# EAGLE design dosimeter (EAGLE 9.6.2)

## Sheet 1 of 2
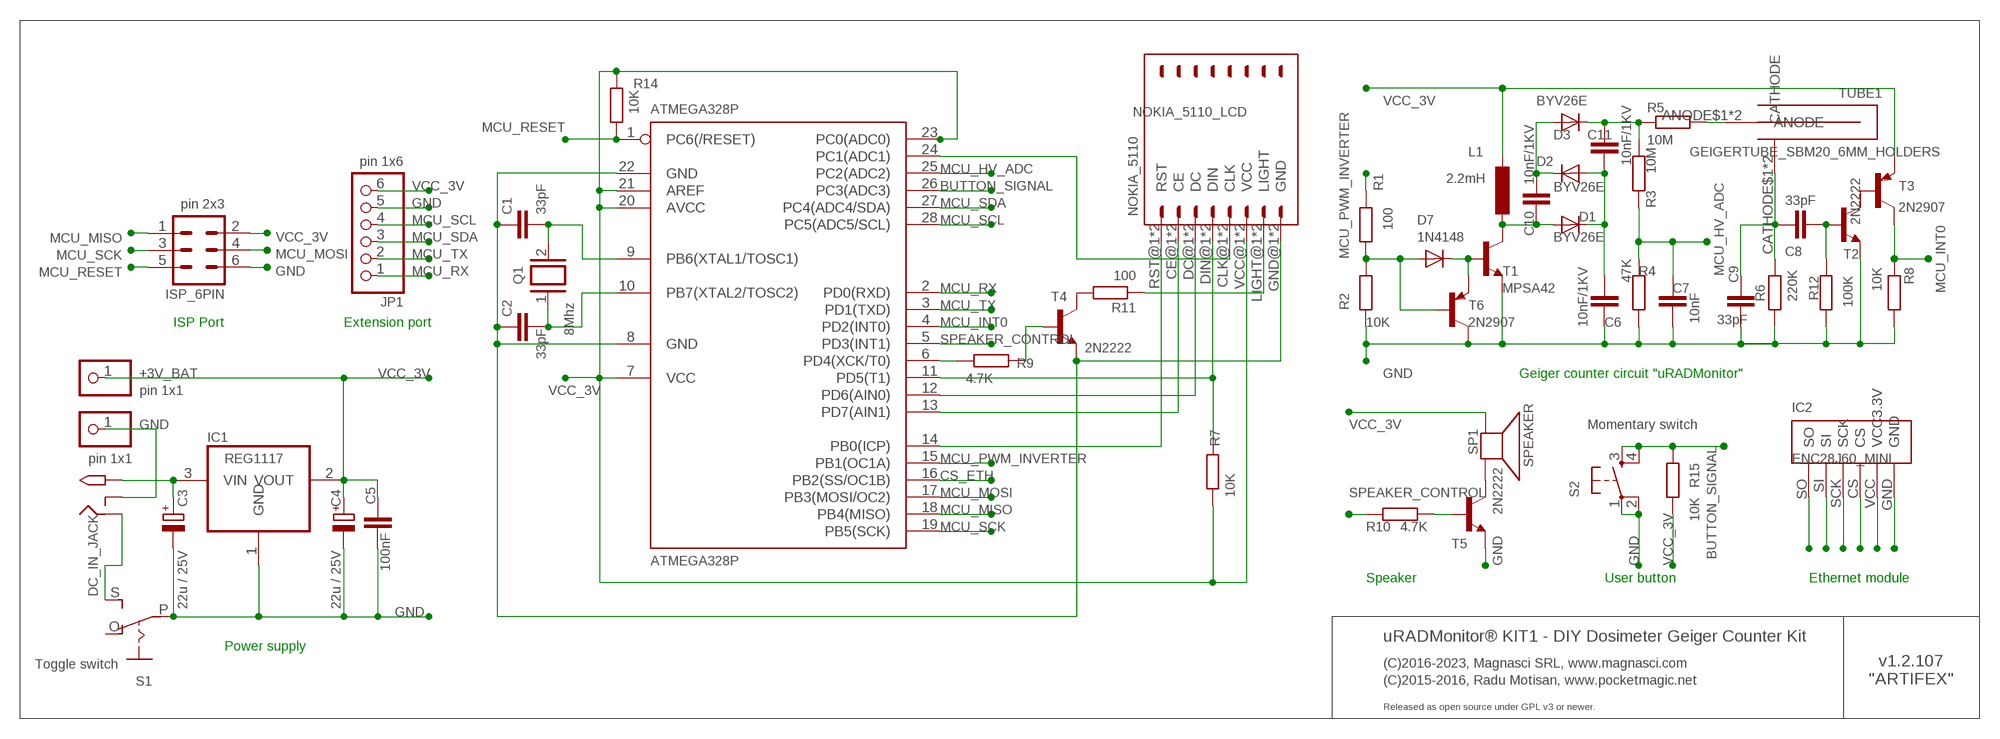
[diagram p0: schematic, sheet 1]

### Parts
+3V_BAT  pin 1x1  PINHD-1X1  [1X01]
ATMEGA328P  ATMEGA328P  MEGA8-P  [DIL28-3]
C1  33pF  C2.5/2  [C2.5-2]
C2  33pF  C2.5/2  [C2.5-2]
C3  22u / 25V  CPOL-EUTT2D4L  [TT2D4L]
C4  22u / 25V  CPOL-EUTT2D4L  [TT2D4L]
C5  100nF  C2.5/2  [C2.5-2]
C6  10nF/1KV  C5/3  [C5B3]
C7  10nF  C2.5/2  [C2.5-2]
C8  33pF  C2.5/2  [C2.5-2]
C9  33pF  C2.5/2  [C2.5-2]
C10  10nF/1KV  C5/3  [C5B3]
C11  10nF/1KV  C5/3  [C5B3]
D1  BYV26E  DIODE-DO41-7.6  [DO41-7.6]
D2  BYV26E  DIODE-DO41-7.6  [DO41-7.6]
D3  BYV26E  DIODE-DO41-7.6  [DO41-7.6]
D7  1N4148  DIODE-D-5  [D-5]
DC_IN_JACK  DC IN JACK  2.1MMJACKTHM  [PJ-102A]
GND  pin 1x1  PINHD-1X1  [1X01]
IC1  REG1117  [SOT223]
IC2  ENC28J60_MINI  [ENC28J60_MINI]
ISP_6PIN  pin 2x3  MA03-2  [MA03-2]
JP1  pin 1x6  PINHD-1X6CLEAN  [1X06-CLEAN]
L1  2.2mH  L-EU0207/10  [0207/10]
NOKIA_5110  NOKIA_5110_LCD  NOKIA5110  [NOKIA5110]
Q1  8Mhz  XTAL/S  [QS]
R1  100  R-EU_0204/7  [0204/7]
R2  10K  R-EU_0204/7  [0204/7]
R3  10M  R-EU_0204/7  [0204/7]
R4  47K  R-EU_0204/7  [0204/7]
R5  10M  R-EU_0204/7  [0204/7]
R6  220K  R-EU_0204/7  [0204/7]
R7  10K  R-EU_0204/7  [0204/7]
R8  10K  R-EU_0204/7  [0204/7]
R9  4.7K  R-EU_0204/7  [0204/7]
R10  4.7K  R-EU_0204/7  [0204/7]
R11  100  R-EU_0204/7  [0204/7]
R12  100K  R-EU_0204/7  [0204/7]
R14  10K  R-EU_0204/7  [0204/7]
R15  10K  R-EU_0204/7  [0204/7]
S1  Toggle switch  EG1218S  [EG1218]
S2  Momentary switch  TAC_SWITCHPTH  [TACTILE-PTH]
SP1  SPEAKER  SPEAKER/AL60P  [AL60P]
T1  MPSA42  2N2222  [TO92-EBC-OVAL]
T2  2N2222  2N2222-NPN-TO92-EBC  [TO92-EBC]
T3  2N2907  [TO92-EBC-OVAL]
T4  2N2222  2N2222-NPN-TO92-EBC  [TO92-EBC]
T5  2N2222  2N2222-NPN-TO92-EBC  [TO92-EBC]
T6  2N2907  [TO92-EBC-OVAL]
TUBE1  GEIGERTUBE_SBM20_6MM_HOLDERS  [GEIGERTUBE_SBM20_6MM_HOLDERS]

### Nets
BUTTON_SIGNAL: ATMEGA328P.26(PC3(ADC3)) R15.1 S2.3 S2.4
CS_ETH: ATMEGA328P.16(PB2(SS/OC1B)) IC2.CS
GND: ATMEGA328P.8(GND) ATMEGA328P.22(GND) C1.1 C2.1 C3.- C4.- C5.1 C6.2 C7.1 C9.2 IC1.1(GND) IC2.GND ISP_6PIN.6 JP1.5 NOKIA_5110.GND@1(GND) NOKIA_5110.GND@2(GND) R2.1 R4.2 R6.1 R8.2 R12.2 S1.P S2.1 S2.2 T1.E T2.E T4.E T5.E T6.C
MCU_HV_ADC: ATMEGA328P.25(PC2(ADC2)) C7.2 R3.1 R4.1
MCU_INT0: ATMEGA328P.4(PD2(INT0)) R8.1 T3.C
MCU_MISO: ATMEGA328P.18(PB4(MISO)) IC2.SO ISP_6PIN.1
MCU_MOSI: ATMEGA328P.17(PB3(MOSI/OC2)) IC2.SI ISP_6PIN.4
MCU_PWM_INVERTER: ATMEGA328P.15(PB1(OC1A)) R1.1
MCU_RESET: ATMEGA328P.1(PC6(/RESET)) ISP_6PIN.5 R14.1
MCU_RX: ATMEGA328P.2(PD0(RXD)) JP1.1
MCU_SCK: ATMEGA328P.19(PB5(SCK)) IC2.SCK ISP_6PIN.3
MCU_SCL: ATMEGA328P.28(PC5(ADC5/SCL)) JP1.4
MCU_SDA: ATMEGA328P.27(PC4(ADC4/SDA)) JP1.3
MCU_TX: ATMEGA328P.3(PD1(TXD)) JP1.2
N$1: ATMEGA328P.9(PB6(XTAL1/TOSC1)) C1.2 Q1.2
N$2: ATMEGA328P.10(PB7(XTAL2/TOSC2)) C2.2 Q1.1
N$3: R11.2 T4.C
N$4: R5.2 TUBE1.ANODE$1(ANODE) TUBE1.ANODE$2(ANODE)
N$7: R9.2 T4.B
N$9: NOKIA_5110.LIGHT@1(LIGHT) NOKIA_5110.LIGHT@2(LIGHT) R11.1
N$10: C10.2 D1.A L1.2 T1.C
N$13: ATMEGA328P.24(PC1(ADC1)) NOKIA_5110.CLK@1(CLK) NOKIA_5110.CLK@2(CLK)
N$15: DC_IN_JACK.RING S1.S
N$16: C10.1 D2.C D3.A
N$20: DC_IN_JACK.RING_SW GND.1
N$21: ATMEGA328P.11(PD5(T1)) NOKIA_5110.DIN@1(DIN) NOKIA_5110.DIN@2(DIN) R7.2
N$22: ATMEGA328P.12(PD6(AIN0)) NOKIA_5110.DC@1(DC) NOKIA_5110.DC@2(DC)
N$23: ATMEGA328P.13(PD7(AIN1)) NOKIA_5110.CE@1(CE) NOKIA_5110.CE@2(CE)
N$24: ATMEGA328P.14(PB0(ICP)) NOKIA_5110.RST@1(RST) NOKIA_5110.RST@2(RST)
N$27: D7.A R1.2 R2.2 T6.B
N$28: C3.+ DC_IN_JACK.TIP IC1.3(VIN)
N$30: C6.1 C11.2 D1.C D2.A
N$31: C11.1 D3.C R3.2 R5.1
N$34: ATMEGA328P.6(PD4(XCK/T0)) R9.1
N$40: SP1.2(-) T5.C
N$41: R10.2 T5.B
N$52: C8.2 C9.1 R6.2 TUBE1.CATHODE$1(CATHODE) TUBE1.CATHODE$2(CATHODE)
N$56: C8.1 R12.1 T2.B
N$59: T2.C T3.B
N$74: D7.C T1.B T6.E
SPEAKER_CONTROL: ATMEGA328P.5(PD3(INT1)) R10.1
VCC_3V: +3V_BAT.1 ATMEGA328P.7(VCC) ATMEGA328P.20(AVCC) ATMEGA328P.21(AREF) ATMEGA328P.23(PC0(ADC0)) C4.+ C5.2 IC1.2(VOUT) IC2.VCC(VCC3.3V) ISP_6PIN.2 JP1.6 L1.1 NOKIA_5110.VCC@1(VCC) NOKIA_5110.VCC@2(VCC) R7.1 R14.2 R15.2 SP1.1(+) T3.E
Unconnected: S1.O

### Notes on the sheet
- ISP Port | Extension port
- Geiger counter circuit "uRADMonitor"
- Speaker | User button | Ethernet module
- uRADMonitor® KIT1 - DIY Dosimeter Geiger Counter Kit
- Power supply
- (C)2016-2023, Magnasci SRL, www.magnasci.com
- (C)2015-2016, Radu Motisan, www.pocketmagic.net
- v1.2.107
  "ARTIFEX"
- Released as open source under GPL v3 or newer.

## Sheet 2 of 2

## Library data of the parts
+3V_BAT GND = adafruit:PINHD-1X1: Pin header 1x1 for 0.1" spacing With round pins
ATMEGA328P = atmel:MEGA8-P: MICROCONTROLLER 8 Kbytes FLASH, 1 kbytes SRAM, 512 bytes EEPROM, USART, 4-channel 10 bit ADC, 2-channel 8 bit ADC Pin compatible with Atmega48, ATMega88, ATMega168 Source: avr.lbr; OC_FARNELL: unknown; OC_NEWARK: unknown
C1 C2 C5-C11 = capacitor-wima:C: CAPACITOR naming: grid - package width
C3 C4 = rcl:CPOL-EU: POLARIZED CAPACITOR, European symbol
D1-D3 D7 = diode:DIODE-: DIODE
DC_IN_JACK = adafruit:2.1MMJACK: 2.1mm x 5.5mm THM DC jack with internal switch. Digikey part #PJ-102A, 4UCON part #05537 2.1mm x 5.5mm SMT DC jack with internal switch. Digikey part #PJ-002A-SMT, 4UCON part #03267 By microbuilder.eu & adafruit.com
IC1 = burr-brown:REG1117: 800mA and 1A Low Dropout (LDO) Positive Regulator 1.8V, 2.5V, 2.85V, 3.3V, 5V, and Adj; MPN: REG1117; OC_FARNELL: 1097566; OC_NEWARK: 14P6981
IC2 = uradmonitor:ENC28J60_MINI
ISP_6PIN = con-lstb:MA03-2: PIN HEADER; OC_FARNELL: unknown; OC_NEWARK: unknown
JP1 = adafruit:PINHD-1X6: PIN HEADER
L1 = rcl:L-EU: INDUCTOR, European symbol
NOKIA_5110 = pocketmagic:NOKIA5110
Q1 = special:XTAL/S: CRYSTAL
R1-R12 R14 R15 = rcl:R-EU_: RESISTOR, European symbol
S1 = adafruit:EG1218: SLIDING SWITCH 0.1" spacing through hole, vertical SPDT slide switch http://www.ladyada.net/library/pcb/eaglelibrary.html
S2 = sparkfun-electromechanical:TAC_SWITCH: Momentary Switch Button commonly used for reset or general input. Spark Fun Electronics SKU : COM-00097 SMT- SWCH-08247
SP1 = adafruit:SPEAKER: SPEAKER Source: Buerklin Added PS12 (for part # PS1240 piezo) http://www.ladyada.net/library/pcb/eaglelibrary.html
T1 = adafruit:2N2222: NPN TRANSISTOR Big oval pads
T2 T4 T5 = transistor-neu-to92:*-NPN-: NPN Transistror
T3 T6 = adafruit:2N2907*: PNP Transistor Big Oval pads
TUBE1 = uradmonitor:GEIGERTUBE_SBM20_6MM_HOLDERS

## Board
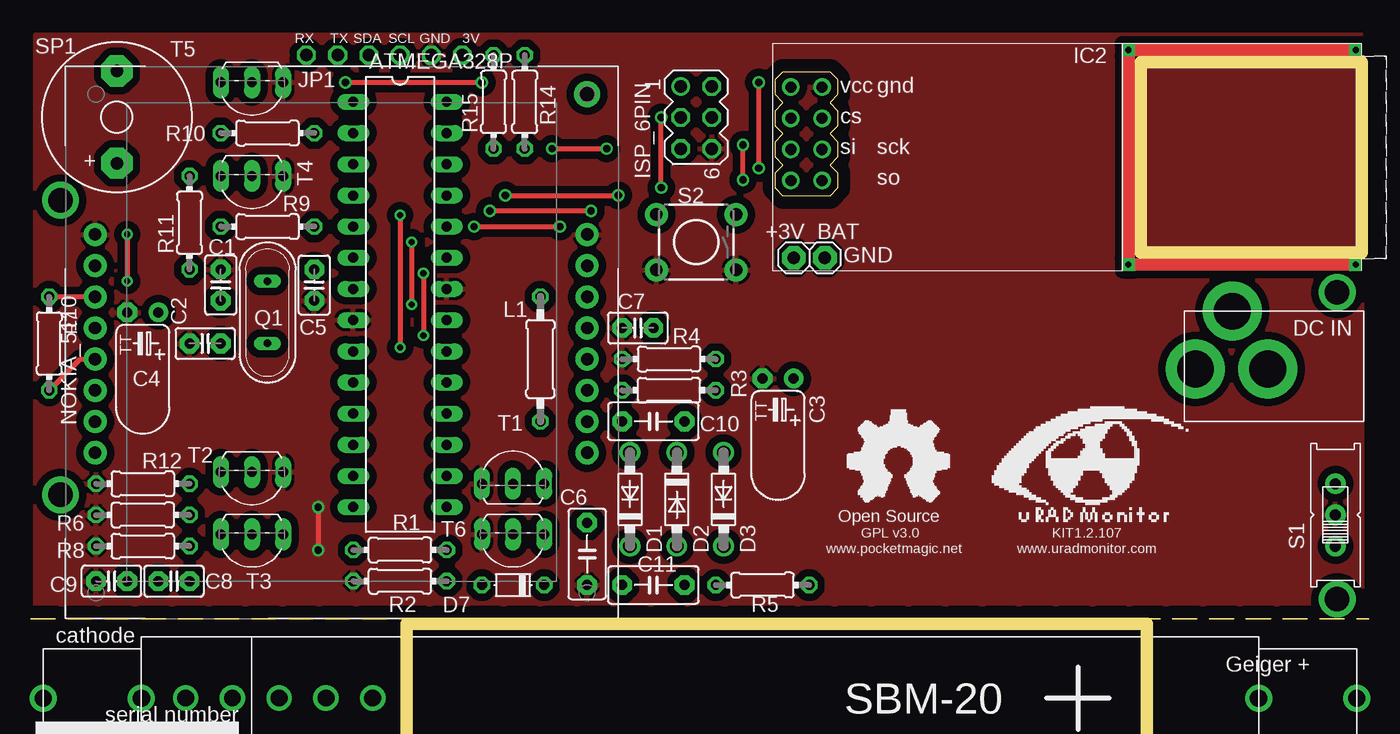
[diagram p1: board, top side]
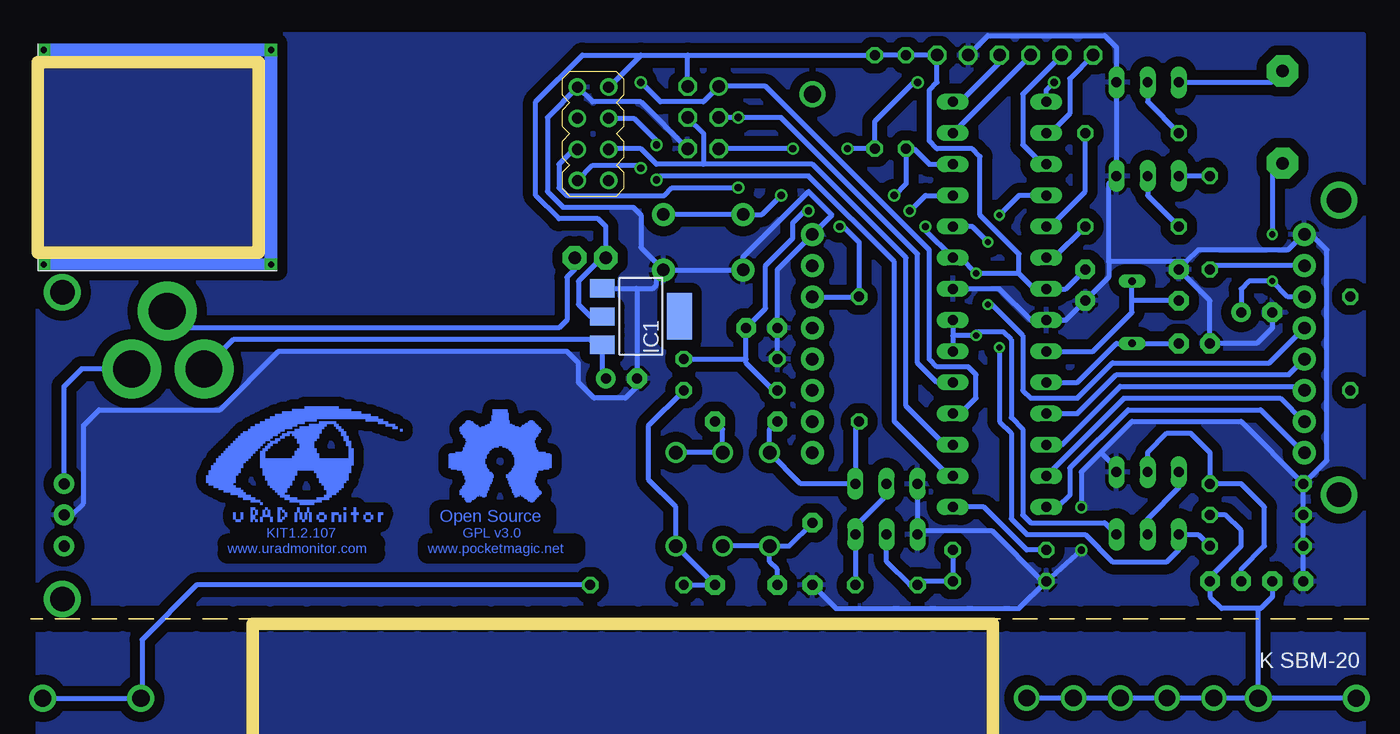
[diagram p2: board, bottom side, seen from below]

Size 109 x 44.61 mm. Coordinates in mm from the lower left corner, seen from the top.
Outline: 0,0 109,0
Copper layers (1*16): Top 0.035mm / dielectric 1.5mm / Bottom 0.035mm
Design rules "default": minimum track width 10mil, minimum drill 24mil, track to track 8mil, track to pad 8mil, pad to pad 8mil, via to via 8mil, smd to smd 8mil, copper to edge 40mil, drill to drill 8mil, minimum pad ring 10mil, minimum via ring 8mil, stop-mask expansion 4mil, vias tented up to drill 0mil, thermal gap 10mil
Milling: 4 lines

### Footprints (pad centres in the part's own frame; a part is rotated, then mirrored left to right if it is on the bottom)
1X01 = drill 1.016 pad 1.93 octagon: 1 0,0
DIL28-3 = drill 0.813 long: 1 -16.51,-3.81; 2 -13.97,-3.81; 3 -11.43,-3.81; 4 -8.89,-3.81; 5 -6.35,-3.81; 6 -3.81,-3.81; 7 -1.27,-3.81; 8 1.27,-3.81; 9 3.81,-3.81; 10 6.35,-3.81; 11 8.89,-3.81; 12 11.43,-3.81; 13 13.97,-3.81; 14 16.51,-3.81; 15 16.51,3.81; 16 13.97,3.81; 17 11.43,3.81; 18 8.89,3.81; 19 6.35,3.81; 20 3.81,3.81; 21 1.27,3.81; 22 -1.27,3.81; 23 -3.81,3.81; 24 -6.35,3.81; 25 -8.89,3.81; 26 -11.43,3.81; 27 -13.97,3.81; 28 -16.51,3.81
C2.5-2 = drill 0.813 pad 1.6 octagon: 1 -1.27,0; 2 1.27,0
TT2D4L = drill 0.813 pad 1.6: + -1.27,0 | drill 0.813 pad 1.6 octagon: - 1.27,0
C5B3 = drill 0.813 pad 1.6 octagon: 1 -2.54,0; 2 2.54,0
DO41-7.6 = drill 1.1 pad 1.7: A 3.81,0; C -3.81,0
D-5 = drill 0.813 octagon: A 2.54,0; C -2.54,0
PJ-102A = drill 3 pad 4.8: RING 0.1,-3.39; RING_SW -4.6,-6.29; TIP 0.1,-9.29
SOT223 = smd 1.499 x 2.007: 1 -2.261,-3.15; 2 0.025,-3.15; 3 2.311,-3.15 | smd 3.81 x 2.007: 4 0,3.15
ENC28J60_MINI = drill 0.9 pad 1.422: CS -21.503,3.433; GND -18.962,5.973; P$1 -21.503,-1.647; P$6 -18.962,3.433; SCK -18.962,0.892; SI -21.503,0.892; SO -18.962,-1.647; VCC -21.503,5.973 | drill 0.5 pad 1 square: P$2 24.5,9; P$3 24.5,-8.5; P$4 6,-8.5; P$5 6,9
MA03-2 = drill 1.016: 1 -2.54,-1.27 | drill 1.016 octagon: 2 -2.54,1.27; 3 0,-1.27; 4 0,1.27; 5 2.54,-1.27; 6 2.54,1.27
1X06-CLEAN = drill 1.016 octagon: 1 -6.35,0; 2 -3.81,0; 3 -1.27,0; 4 1.27,0; 5 3.81,0; 6 6.35,0
0207/10 = drill 0.813 octagon: 1 -5.08,0; 2 5.08,0
NOKIA5110 = drill 1.016 pad 1.88: CE@1 2.53,0; CE@2 2.53,40.08; CLK@1 10.15,0; CLK@2 10.15,40.08; DC@1 5.07,0; DC@2 5.07,40.08; DIN@1 7.61,0; DIN@2 7.61,40.08; GND@1 17.77,0; GND@2 17.77,40.08; LIGHT@1 15.23,0; LIGHT@2 15.23,40.08; RST@1 -0.01,0; RST@2 -0.01,40.08; VCC@1 12.69,0; VCC@2 12.69,40.08
QS = drill 0.61 long: 1 -2.54,0; 2 2.54,0
0204/7 = drill 0.813 octagon: 1 -3.81,0; 2 3.81,0
EG1218 = drill 0.9 pad 1.676: O -2.54,0; P 0,0; S 2.54,0
TACTILE-PTH = drill 1.016 pad 1.88: 1 -3.251,2.261; 2 3.251,2.261; 3 -3.251,-2.261; 4 3.251,-2.261
AL60P = drill 1.016 pad 2.54 octagon: 1 -3.759,0; 2 3.759,0
TO92-EBC-OVAL = drill 0.813 long: B 0,-1.27; C 2.54,-1.27; E -2.54,-1.27
TO92-EBC = drill 0.813 long: B 0,-1.27; C 2.54,-1.27; E -2.54,-1.27
GEIGERTUBE_SBM20_6MM_HOLDERS = drill 1.4 pad 2.2: ANODE$1 47.5,0; ANODE$2 55.5,0; CATHODE$1 -51.5,0; CATHODE$2 -43.5,0

### Placement (x,y rotation side)
+3V_BAT  62.15,29.43 0 top
ATMEGA328P  30.09,25.62 270 top
C1  15.48,27.21 270 top
C2  14.21,22.45 0 top
C3  60.88,19.59 180 top
C4  9.13,24.99 180 top
C5  23.1,27.21 90 top
C6  45.33,5.3 270 top
C7  49.45,23.72 0 top
C8  11.67,3.08 0 top
C9  6.59,3.08 180 top
C10  50.72,16.1 180 top
C11  50.72,2.77 180 top
D1  48.82,9.75 90 top
D2  52.63,9.75 270 top
D3  56.44,9.75 90 top
D7  39.29,2.77 180 top
DC_IN_JACK  104.17,20.48 270 top
GND  64.69,29.43 0 top
IC1  59.3,24.67 270 bottom
IC2  83.42,37.37 0 top
ISP_6PIN  54.21,40.86 270 top
JP1  28.81,45.95 0 top
L1  41.52,21.18 270 top
NOKIA_5110  45.33,13.56 90 top
Q1  19.29,24.99 90 top
R1  30.09,5.62 0 top
R2  30.09,3.08 0 top
R3  51.99,18.64 0 top
R4  51.99,21.18 180 top
R5  59.61,2.77 0 top
R6  9.13,8.48 0 top
R7  1.51,22.45 270 top
R8  9.13,5.94 180 top
R9  19.29,31.97 180 top
R10  19.29,39.59 180 top
R11  12.94,32.29 90 top
R12  9.13,11.02 180 top
R14  40.24,42.13 90 top
R15  37.7,42.13 90 top
S1  106.28,8.48 90 top
S2  54.21,30.7 180 top
SP1  7.02,40.89 90 top
T1  39.29,12.29 0 top
T2  18.02,10.7 180 top
T3  18.02,5.62 180 top
T4  18.02,34.83 180 top
T5  18.02,42.45 180 top
T6  39.29,5.62 180 top
TUBE1  52.52,-6.45 0 top  (outside the outline)

### Tracks (layer width: path | path; a pad name or v marks a point on that pad's centre or on a via)
BUTTON_SIGNAL  (via drill 0.6 pad 0.25)
  Top 0.406: v38.66,34.52 v47.87,34.52
  Bottom 0.406: 34.85,37.05 ATMEGA328P.26 35.8,37.05 37.07,38.32 R15.1 37.7,35.47 v38.66,34.52 | S2.3 S2.4 49.41,32.97 v47.87,34.52
CS_ETH  (via drill 0.6 pad 0.3)
  Top 0.406: v58.02,35.78 v58.02,38.64
  Bottom 0.406: v58.02,35.78 57.71,36.1 45.64,36.1 38.66,29.12 38.66,16.1 34.21,11.65 ATMEGA328P.16 | IC2.CS 59.87,40.8 58.02,38.96 v58.02,38.64
GND  (via drill 0.6 pad 0.25)
  Top 0.406: v23.42,9.11 v23.42,5.62
  Bottom 0.406: R12.2 R6.1 R8.2 C9.2 | JP1.5 31.04,47.53 21.51,47.53 20.56,46.58 T5.E T4.E 21.2,35.47 21.2,29.12 | R12.2 3.42,12.92 3.42,30.07 4.69,31.34 NOKIA_5110.GND@2 5.25,31.34 5.32,31.34 6.59,30.07 13.89,30.07 14.84,29.12 | ATMEGA328P.22 30.09,26.89 27.54,24.35 ATMEGA328P.8 24.69,24.35 C5.1 21.2,27.85 21.2,29.12 | 14.84,29.12 C1.1 12.94,25.94 C2.1 9.13,22.45 7.86,23.72 C4.- | 14.84,29.12 21.2,29.12 | ISP_6PIN.6 59.3,42.13 63.25,42.13 IC2.GND 64.46,43.32 66.92,40.86 66.92,34.83 65.64,33.56 59.93,33.56 59.3,32.93 59.3,30.27 S2.1 | 21.83,13.56 23.42,11.97 v23.42,9.11 | 21.83,13.56 19.29,16.1 10.4,16.1 R12.2 | R2.1 v23.42,5.62 | T1.E 36.75,7.21 | T6.C 36.75,7.21 | 36.75,7.21 30.72,7.21 26.59,3.08 R2.1 | R2.1 28.5,0.86 43.42,0.86 C6.2 | R4.2 C7.1 48.18,28.47 NOKIA_5110.GND@1 | NOKIA_5110.GND@1 | NOKIA_5110.GND@1 43.74,32.93 45.64,34.83 50.96,29.51 S2.2 S2.1 | S2.1 57.47,28.41 | S2.1 58.02,27.89 58.02,27.21 58.3,26.93 IC1.1 59.65,26.93 59.61,26.89 C3.- 59.61,18.96 60.56,18 63.1,18 64.38,19.27 64.38,20.86 65.33,21.81 88.82,21.81 93.58,17.05 103.43,17.05 104.7,15.78 104.7,9.43 105.65,8.48 S1.P | T2.E 20.56,12.29 21.83,13.56
  pour Top (isolate 0.61): 0.42,47.62 108.42,47.62 108.42,0.12 0.42,0.12
  pour Bottom (isolate 0.813): 0.42,47.62 108.42,47.62 108.42,-12.38 0.42,-12.38
MCU_HV_ADC  (via drill 0.6 pad 0.25)
  Top 0.406: v45.64,33.24 v37.39,33.24
  Bottom 0.406: ATMEGA328P.25 36.12,34.52 v37.39,33.24 | R3.1 48.5,18.64 50.72,20.86 50.72,21.18 | 50.72,21.18 C7.2 49.13,25.31 49.13,28.8 46.91,31.02 46.91,32.29 45.96,33.24 v45.64,33.24 | R4.1 50.72,21.18
MCU_INT0  (via drill 0.5 pad 0.25)
  Top 0.406: v30.09,32.91 30.1,32.59 30.09,32.61 v30.09,22.13
  Bottom 0.406: v30.09,22.13 30.09,16.1 29.13,15.15 29.13,8.16 27.86,6.89 23.1,6.89 20.88,4.67 16.43,4.67 15.48,5.62 T3.C 13.89,6.89 R8.1 | 30.07,32.61 v30.09,32.91 28.48,34.52 ATMEGA328P.4
MCU_MISO  (via drill 0.6 pad 0.25)
  Top 0.406: v59.3,43.72 v59.3,36.74
  Bottom 0.406: IC2.SO 63.22,36.98 59.53,36.98 v59.3,36.74 | v59.3,43.72 57.71,42.13 54.21,42.13 ISP_6PIN.1 49.13,43.41 35.8,30.07 35.8,21.18 35.16,20.54 32.63,20.54 31.99,19.91 31.99,18 33.26,16.73 ATMEGA328P.18
MCU_MOSI
  Bottom 0.406: 54.21,37.05 45.33,37.05 37.7,29.43 37.7,17.37 34.53,14.2 ATMEGA328P.17 | ISP_6PIN.4 54.21,39.59 54.21,37.05 | 54.21,37.05 58.02,37.05 59.3,38.32 61.86,38.32 IC2.SI
MCU_PWM_INVERTER
  Bottom 0.406: R1.1 27.86,5.62 31.36,9.11 ATMEGA328P.15
MCU_RESET  (via drill 0.6 pad 0.25, 0.6 pad 0.41)
  Top 0.406: v25.64,43.72 v36.75,43.72 | v42.47,38.32 v46.91,38.32
  Bottom 0.406: ATMEGA328P.1 26.27,43.09 v25.64,43.72 | v36.75,43.72 37.07,43.72 40.24,40.55 R14.1 v42.47,38.32 | v46.91,38.32 ISP_6PIN.5
MCU_RX
  Bottom 0.406: JP1.1 24.37,44.04 24.37,41.18 25.96,39.59 ATMEGA328P.2
MCU_SCK  (via drill 0.6 pad 0.25)
  Top 0.406: v51.36,35.15 v51.36,40.86
  Bottom 0.406: IC2.SCK 64.52,38.32 64.69,38.32 65.96,37.05 65.96,35.15 65.33,34.52 57.39,34.52 56.76,35.15 v51.36,35.15 | ATMEGA328P.19 35.16,19.27 36.75,20.86 36.75,29.75 47.87,40.86 v51.36,40.86 ISP_6PIN.3
MCU_SCL
  Bottom 0.406: JP1.4 30.09,45.31 33.26,42.13 ATMEGA328P.28
MCU_SDA
  Bottom 0.406: JP1.3 ATMEGA328P.27
MCU_TX
  Bottom 0.406: ATMEGA328P.3 26.59,37.05 28.18,38.64 28.18,42.77 JP1.2
N$1
  Bottom 0.406: ATMEGA328P.9 22.47,21.81 19.29,24.99 19.29,25.94 | 19.29,25.94 Q1.2 | C1.2 19.29,25.94
N$2
  Bottom 0.406: C2.2 Q1.1 20.56,22.45 23.73,19.27 ATMEGA328P.10
N$3
  Bottom 0.406: R11.2 T4.C
N$4
  Bottom 0.406: TUBE1.ANODE$2 TUBE1.ANODE$1 99.94,-6.45 99.94,-1.68 95.49,2.77 R5.2
N$5  (via drill 2 pad 3)
  other vias: 2.42,34.12
N$6  (via drill 2 pad 3)
  other vias: 106.42,1.62
N$7
  Bottom 0.406: T4.B 18.02,34.52 R9.2
N$8  (via drill 2 pad 3)
  other vias: 2.42,10.12
N$9
  Bottom 0.406: NOKIA_5110.LIGHT@2 12.63,28.79 R11.1
N$10
  Bottom 0.406: C10.2 48.82,15.46 D1.A 46.28,11.02 T1.C 41.83,15.78 L1.2
N$11  (via drill 2 pad 3)
  other vias: 106.42,26.62
N$13  (via drill 0.5 pad 0.25)
  Top 0.406: v31.04,30.7 v31.04,25.62
  Bottom 0.406: 5.25,23.72 NOKIA_5110.CLK@2 8.09,20.86 20.88,20.86 23.73,18 27.54,18 28.18,18.64 28.18,23.08 30.72,25.62 v31.04,25.62 | ATMEGA328P.24 32.31,31.97 v31.04,30.7
N$15
  Bottom 0.406: DC_IN_JACK.RING 104.86,20.38 106.28,18.96 S1.S
N$16
  Bottom 0.406: D3.A D2.C 52.63,15.46 C10.1
N$20
  Bottom 0.406: GND.1 64.69,28.48 65.33,27.85 65.33,24.35 65.96,23.72 96.53,23.72 DC_IN_JACK.RING_SW
N$21
  Top 0.406: R7.2 4.04,21.17 NOKIA_5110.DIN@2
  Bottom 0.406: ATMEGA328P.11 23.73,16.73 20.56,19.91 6.5,19.91 NOKIA_5110.DIN@2
N$22
  Bottom 0.406: ATMEGA328P.12 25,14.2 20.24,18.96 5.64,18.96 5.32,18.64 5.25,18.64 NOKIA_5110.DC@2
N$23
  Bottom 0.406: NOKIA_5110.CE@2 5.25,16.1 5.32,16.1 7.23,18 19.93,18 ATMEGA328P.13
N$24
  Bottom 0.406: NOKIA_5110.RST@2 5.25,13.56 5.32,13.56 8.81,17.05 19.61,17.05 24.37,12.29 24.37,10.07 25.32,9.11 ATMEGA328P.14
N$27
  Bottom 0.406: R1.2 R2.2 36.44,3.08 D7.A 37.39,2.77 39.29,4.67 T6.B
N$28
  Bottom 0.406: 62.36,22.45 IC1.3 | IC1.3 63.02,22.36 63.42,22.77 92.5,22.77 DC_IN_JACK.TIP | IC1.3 62.44,19.88 C3.+
N$30
  Bottom 0.406: D1.C 47.23,5.94 C6.1 | D1.C D2.A | C11.2 48.18,4.03 48.82,4.67 D1.C
N$31
  Bottom 0.406: R3.2 58.66,15.78 58.66,11.34 56.44,9.11 D3.C C11.1 R5.1
N$34
  Bottom 0.406: ATMEGA328P.6 25.64,29.43 R9.1
N$40
  Bottom 0.406: T5.C 7.95,43.72 SP1.2
N$41
  Bottom 0.406: T5.B 18.02,42.13 R10.2
N$45  (via drill 1.4)
  other vias: 45.33,42.77
N$52  (via drill 1.37)
  Bottom 0.406: R6.2 11.67,8.48 10.4,7.21 10.4,5.94 12.94,3.4 C8.2 12.94,1.81 11.99,0.86 9.13,0.86 | TUBE1.CATHODE$2 9.02,0.75 9.13,0.86 | C9.1 7.86,1.81 8.81,0.86 9.13,0.86 | TUBE1.CATHODE$1 TUBE1.CATHODE$2 | TUBE1.CATHODE$2 v12.62,-6.45 v12.62,-6.44 v16.43,-6.44 v20.24,-6.44 v24.05,-6.44 v27.86,-6.44
N$56
  Bottom 0.406: C8.1 10.4,4.03 8.49,5.94 8.49,9.11 10.4,11.02 R12.1 12.94,13.56 14.53,15.15 16.43,15.15 18.02,13.56 T2.B
N$59
  Bottom 0.406: T3.B 18.02,8.16 15.48,10.7 T2.C
N$74
  Bottom 0.406: D7.C T6.E 41.83,7.53 39.29,10.07 T1.B
SPEAKER_CONTROL
  Bottom 0.406: ATMEGA328P.5 25.96,31.97 23.1,34.83 R10.1
VCC_3V  (via drill 0.5 pad 0.25, 0.6 pad 0.25)
  Top 0.406: v31.99,28.16 v31.99,23.08 | v7.86,31.34 v7.86,27.53 | v36.12,31.97 v43.1,31.97 | R7.1 NOKIA_5110.VCC@2
  Bottom 0.406: 28.5,28.16 27.23,26.89 ATMEGA328P.7 24.69,26.89 C5.2 | 28.5,28.16 v31.99,28.16 33.26,29.43 ATMEGA328P.23 36.12,31.66 v36.12,31.97 | NOKIA_5110.VCC@1 | 28.5,28.16 28.5,29.75 31.67,32.93 31.67,37.69 32.31,38.32 35.16,38.32 35.8,38.96 35.8,43.09 35.16,43.72 JP1.6 R15.2 R14.2 55.48,45.95 | SP1.1 7.14,37.14 7.86,36.42 v7.86,31.34 | ATMEGA328P.21 33.89,23.08 | 33.89,23.08 ATMEGA328P.20 | 33.89,23.08 v31.99,23.08 31.99,23.4 29.77,23.4 29.13,22.77 29.13,16.42 28.18,15.46 28.18,8.48 27.54,7.84 21.51,7.84 T3.E | ISP_6PIN.2 55.48,45.95 | NOKIA_5110.VCC@1 41.84,26.25 L1.1 41.52,30.7 42.78,31.97 v43.1,31.97 | IC2.VCC 61.89,43.34 59.3,45.95 | 59.3,45.95 55.48,45.95 | IC1.2 63.4,24.65 64.38,25.62 64.38,27.53 62.47,29.43 +3V_BAT.1 62.15,31.97 62.79,32.61 65.96,32.61 67.87,34.52 67.87,42.13 64.06,45.95 59.3,45.95 | NOKIA_5110.VCC@2 6.58,26.25 v7.86,27.53 9.76,27.53 10.4,26.89 C4.+
(copper drawn outside any net)
  shapes: Bottom area x342

### Text on the board
Bottom: Open Source | GPL v3.0 | KIT1.2.107 | www.pocketmagic.net | www.uradmonitor.com
tPlace: RX | TX | SDA | SCL | GND | 3V | + | DC IN | Open Source | GPL v3.0 | KIT1.2.107 | www.pocketmagic.net | www.uradmonitor.com | Geiger + | serial number
bPlace: K SBM-20